# EAGLE design gate (EAGLE 8.5.0)
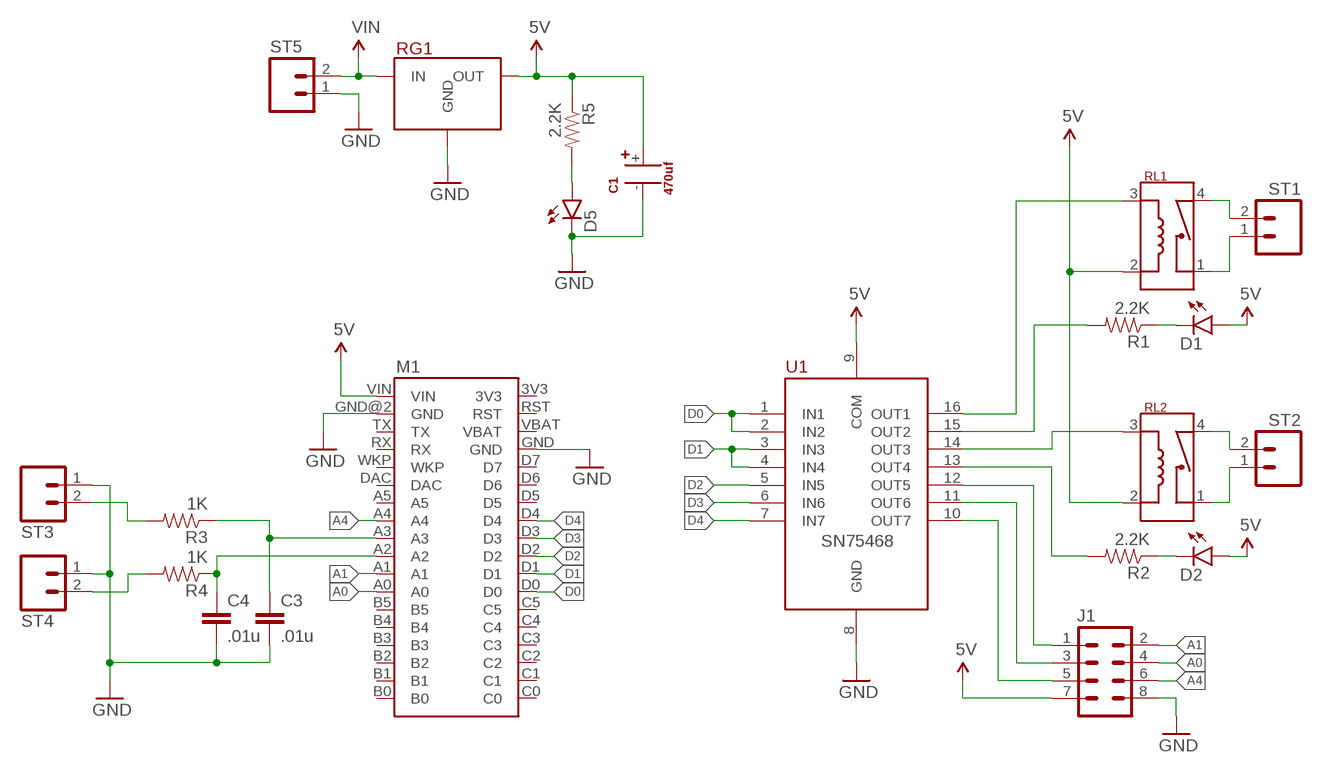
[diagram p0: schematic, sheet 1]

## Parts
C1  470uf  CAPACITOR-AXIAL10X25  [CAP-AXIAL-10X25]
C3  .01u  CAP0603-CAP  [0603-CAP]
C4  .01u  CAP0603-CAP  [0603-CAP]
D1  LED0603  [LED-0603]
D2  LED0603  [LED-0603]
D5  LED0603  [LED-0603]
J1  M04X2  [2X4]
M1  ELECTRON  [ELECTRON]
R1  2.2K  RESISTOR0603  [0603-RES]
R2  2.2K  RESISTOR0603  [0603-RES]
R3  1K  RESISTOR0603  [0603-RES]
R4  1K  RESISTOR0603  [0603-RES]
R5  2.2K  RESISTOR0603  [0603-RES]
RG1  TRACO_TSR_2  [TRACO_TSR_2]
RL1  HE3600_RELAY  [HE3600_RELAY]
RL2  HE3600_RELAY  [HE3600_RELAY]
ST1  SCREWTERM_2  [SCREWTERM_0.2X2]
ST2  SCREWTERM_2  [SCREWTERM_0.2X2]
ST3  SCREWTERM_2  [SCREWTERM_0.2X2]
ST4  SCREWTERM_2  [SCREWTERM_0.2X2]
ST5  SCREWTERM_2  [SCREWTERM_0.2X2]
U1  SN75468  [SOIC16]

## Nets
5V: C1.+ D1.A D2.A J1.7 M1.VIN R5.1 RG1.3(OUT) RL1.2(R1) RL2.2(R1) U1.9(COM)
A0: J1.4 M1.A0
A1: J1.2 M1.A1
A4: J1.6 M1.A4
D0: M1.D0 U1.1(IN1) U1.2(IN2)
D1: M1.D1 U1.3(IN3) U1.4(IN4)
D2: M1.D2 U1.5(IN5)
D3: M1.D3 U1.6(IN6)
D4: M1.D4 U1.7(IN7)
GND: C1.- C3.2 C4.2 D5.C J1.8 M1.GND M1.GND@2(GND) RG1.2(GND) ST3.1 ST4.1 ST5.1 U1.8(GND)
L5: J1.1 U1.12(OUT5)
L6: J1.3 U1.11(OUT6)
L7: J1.5 U1.10(OUT7)
N$1: D2.C R2.1
N$2: RL1.4(C2) ST1.2
N$3: D1.C R1.1
N$4: RL2.4(C2) ST2.2
N$5: R2.2 U1.13(OUT4)
N$6: R1.2 U1.15(OUT2)
N$7: C4.1 M1.A2 R4.1
N$8: C3.1 M1.A3 R3.1
N$9: RL2.1(C1) ST2.1
N$13: RL1.1(C1) ST1.1
N$14: D5.A R5.2
N$17: R4.2 ST4.2
N$18: R3.2 ST3.2
N$22: RL2.3(R2) U1.14(OUT3)
N$33: RL1.3(R2) U1.16(OUT1)
VIN: RG1.1(IN) ST5.2
Unconnected: M1.A5 M1.B0 M1.B1 M1.B2 M1.B3 M1.B4 M1.B5 M1.C0 M1.C1 M1.C2 M1.C3 M1.C4 M1.C5 M1.D5 M1.D6 M1.D7 M1.DAC M1.RST M1.RX M1.TX M1.VBAT M1.WKP

## Power pins joined to a net without a drawn wire
3V3: M1.3V3

## Library data of the parts
C1 = Puffin:CAPACITOR-AXIAL
C3 C4 = SparkFun-Capacitors:CAP: Capacitor Standard 0603 ceramic capacitor, and 0.1" leaded capacitor.
D1 D2 D5 = SparkFun-LED:LED: LEDs Standard schematic elements and footprints for 5mm, 3mm, 1206, and 0603 sized LEDs. 5mm - Spark Fun Electronics SKU : COM-00529 (and others)
J1 = SparkFun-Connectors:M04X2: .1" header, two rows of four.
M1 = Puffin:ELECTRON
R1-R5 = SparkFun-Resistors:RESISTOR: Resistor Basic schematic elements and footprints for 0603, 1206, and PTH resistors.
RG1 = Puffin:TRACO_TSR_2
RL1 RL2 = Puffin:HE3600_RELAY
ST1-ST5 = Puffin:SCREWTERM_2
U1 = Puffin:SN75468

## Board
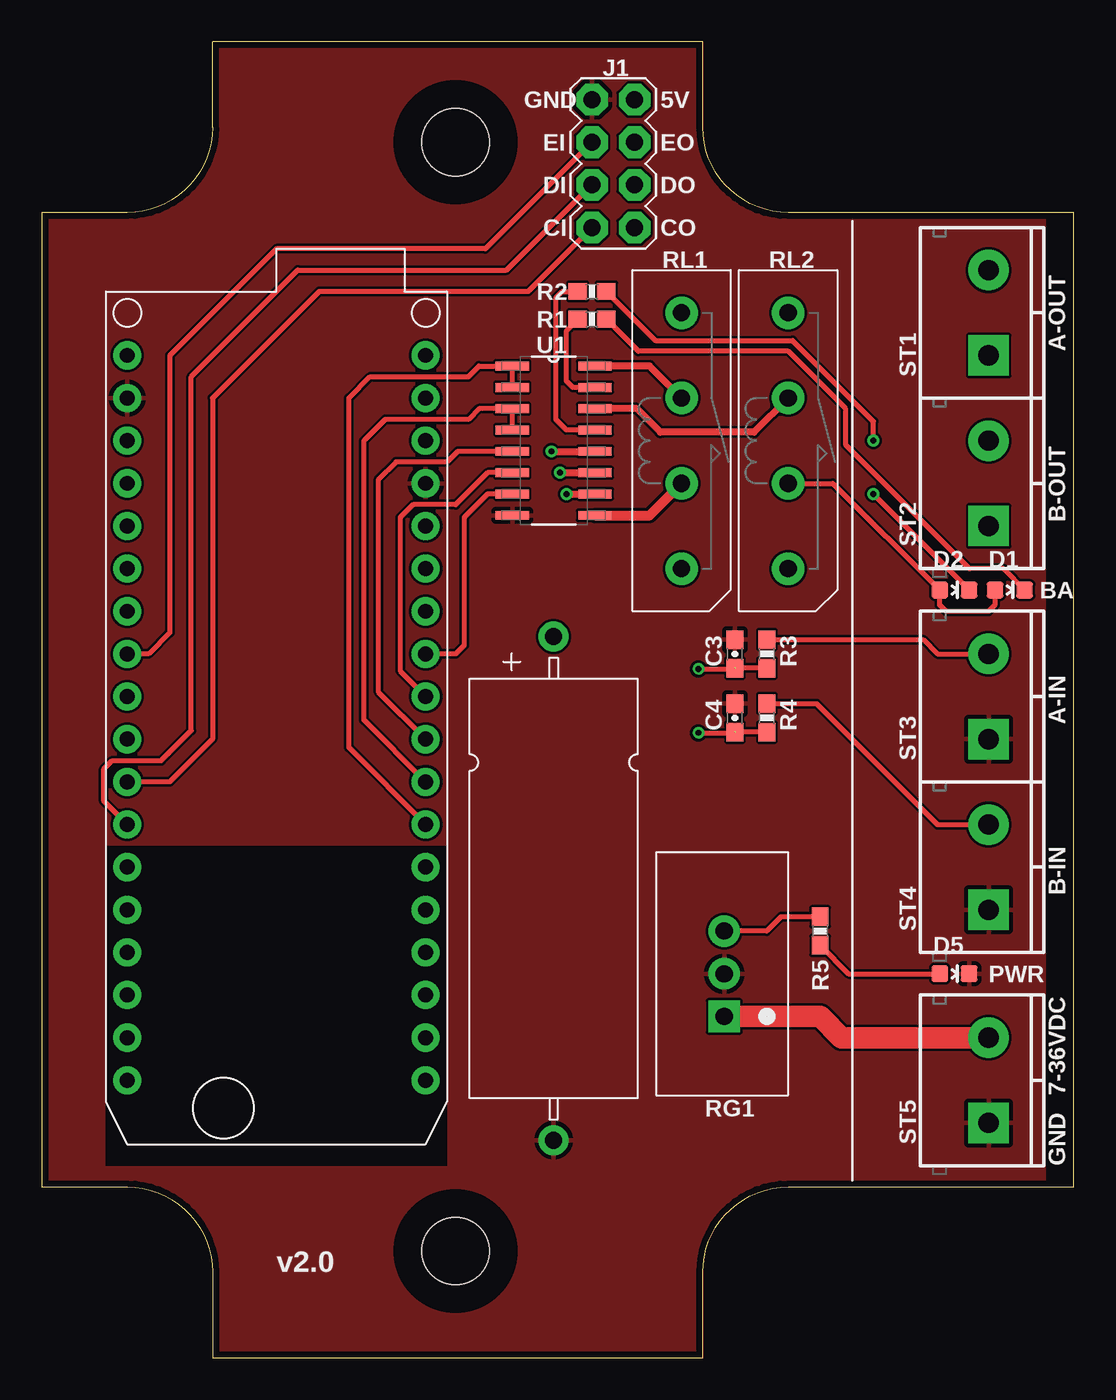
[diagram p1: board, top side]
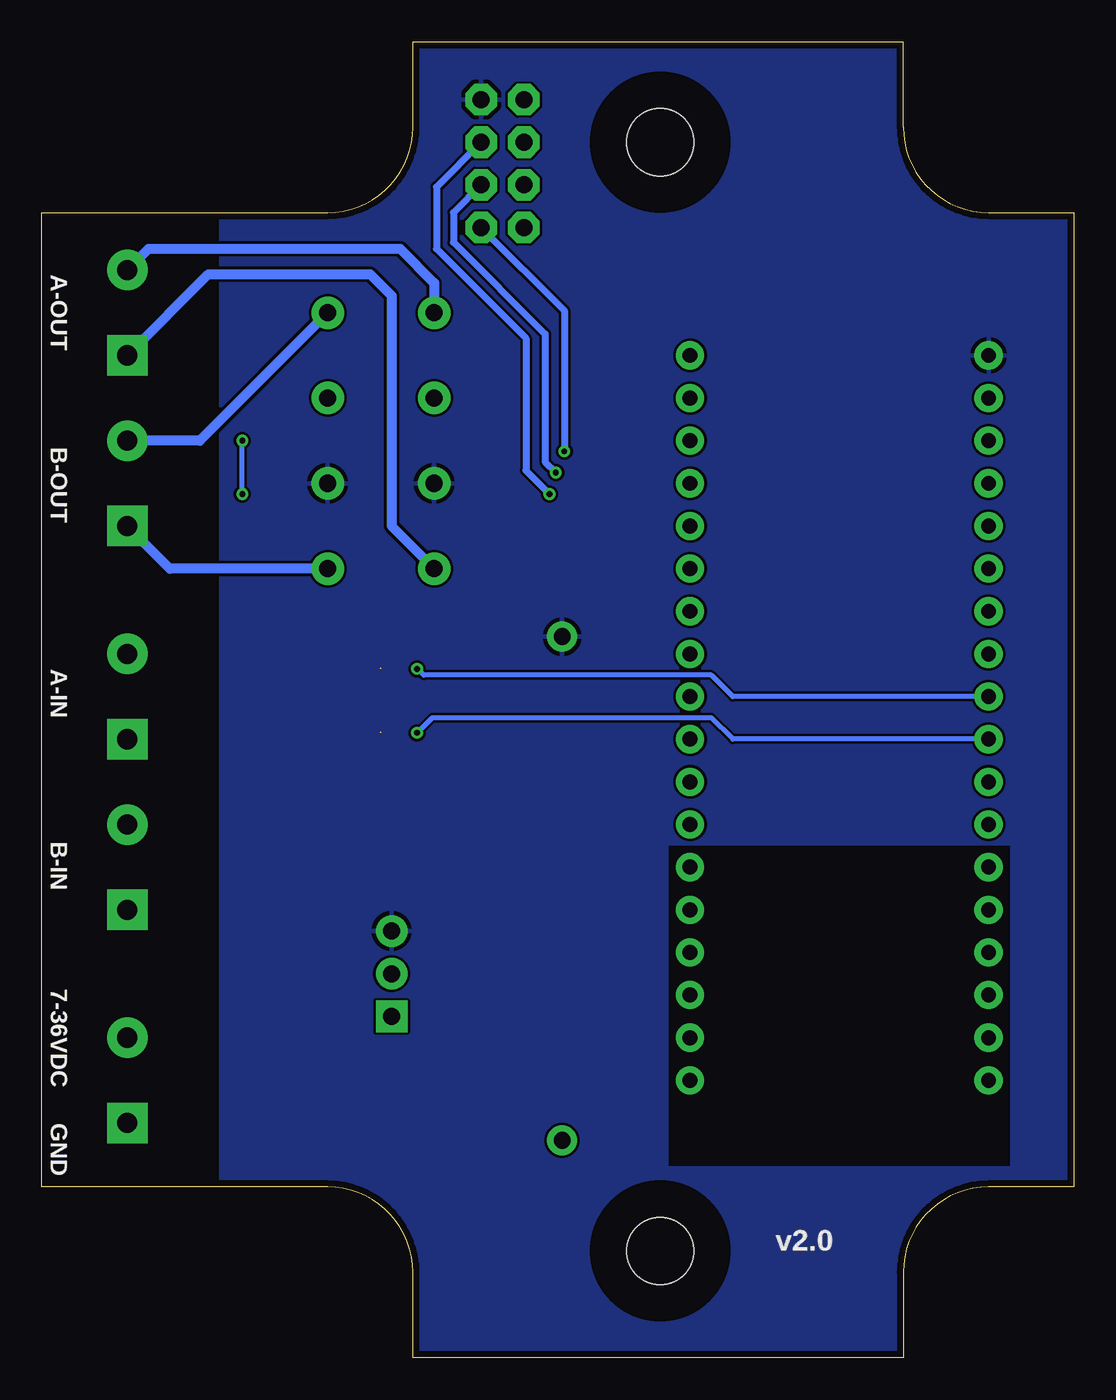
[diagram p2: board, bottom side, seen from below]

Size 61.47 x 78.36 mm. Coordinates in mm from the lower left corner, seen from the top.
Outline: 39.37,73.28 39.37,78.36 10.16,78.36 10.16,73.28 arc-90 5.08,68.2 0,68.2 0,10.16 5.08,10.16 arc-90 10.16,5.08 10.16,0 39.37,0 39.37,5.08 arc-90 44.45,10.16 61.47,10.16 61.47,68.2 44.45,68.2
Outline: 44.45,68.2 arc-90 39.37,73.28
Outline: 44.45,68.2 arc-90 39.37,73.28
Copper layers (1*16): Top 0.0356mm / dielectric 1.5011mm / Bottom 0.0356mm
Design rules "oshpark-2layer": minimum track width 6mil, minimum drill 13mil, track to track 6mil, track to pad 6mil, pad to pad 6mil, via to via 6mil, smd to smd 6mil, copper to edge 15mil, drill to drill 6mil, minimum pad ring 7mil, minimum via ring 7mil, stop-mask expansion 2.5mil, vias tented up to drill 0mil, thermal gap 10mil
Holes 3.99 mm at 24.64,72.39 24.64,6.35
tRestrict: area 21.1,68.8 to 28.2,75.9; area 21.1,2.8 to 28.2,9.9; area 3.8,11.4 to 24.1,30.5
bRestrict: area 20.6,68.3 to 28.7,76.5; area 20.6,2.3 to 28.7,10.4; area 3.8,11.4 to 24.1,30.5

### Footprints (pad centres in the part's own frame; a part is rotated, then mirrored left to right if it is on the bottom)
CAP-AXIAL-10X25 = drill 1 pad 1.778: + 15,0; - -15,0
0603-CAP = smd 1.1 x 1: 1 -0.85,0; 2 0.85,0
LED-0603 = smd 1 x 1: A 0,-0.877; C 0,0.877
2X4 = drill 1.016 pad 1.88 octagon: 1 -3.81,-1.27; 2 -3.81,1.27; 3 -1.27,-1.27; 4 -1.27,1.27; 5 1.27,-1.27; 6 1.27,1.27; 7 3.81,-1.27; 8 3.81,1.27
ELECTRON = drill 0.889 pad 1.676: 3V3 17.78,0; A0 0,-27.94; A1 0,-25.4; A2 0,-22.86; A3 0,-20.32; A4 0,-17.78; A5 0,-15.24; B0 0,-43.18; B1 0,-40.64; B2 0,-38.1; B3 0,-35.56; B4 0,-33.02; B5 0,-30.48; C0 17.78,-43.18; C1 17.78,-40.64; C2 17.78,-38.1; C3 17.78,-35.56; C4 17.78,-33.02; C5 17.78,-30.48; D0 17.78,-27.94; D1 17.78,-25.4; D2 17.78,-22.86; D3 17.78,-20.32; D4 17.78,-17.78; D5 17.78,-15.24; D6 17.78,-12.7; D7 17.78,-10.16; DAC 0,-12.7; GND 17.78,-7.62; GND@2 0,-2.54; RST 17.78,-2.54; RX 0,-7.62; TX 0,-5.08; VBAT 17.78,-5.08; VIN 0,0; WKP 0,-10.16
0603-RES = smd 1.1 x 1: 1 -0.85,0; 2 0.85,0
TRACO_TSR_2 = drill 1.016 pad 1.88 square: 1 -2.54,0 | drill 1.016 pad 1.88: 2 0,0; 3 2.54,0
HE3600_RELAY = drill 1.016 pad 1.93: 1 0,0; 2 0,-5.08; 3 0,-10.16; 4 0,-15.24
SCREWTERM_0.2X2 = drill 1.2 pad 2.413 square: 1 0,0 | drill 1.2 pad 2.413: 2 5.08,0
SOIC16 = smd 1.981 x 0.533: 1 -2.464,4.445; 2 -2.464,3.175; 3 -2.464,1.905; 4 -2.464,0.635; 5 -2.464,-0.635; 6 -2.464,-1.905; 7 -2.464,-3.175; 8 -2.464,-4.445; 9 2.464,-4.445; 10 2.464,-3.175; 11 2.464,-1.905; 12 2.464,-0.635; 13 2.464,0.635; 14 2.464,1.905; 15 2.464,3.175; 16 2.464,4.445

### Placement (x,y rotation side)
C1  30.48,27.94 90 top
C3  41.28,41.91 90 top
C4  41.28,38.1 90 top
D1  57.66,45.72 270 top
D2  54.36,45.72 270 top
D5  54.36,22.86 270 top
J1  34.04,71.12 90 top
M1  5.08,59.69 0 top
R1  32.77,61.85 180 top
R2  32.77,63.5 180 top
R3  43.18,41.91 90 top
R4  43.18,38.1 90 top
R5  46.36,25.4 270 top
RG1  40.64,22.86 90 top
RL1  38.1,46.99 180 top
RL2  44.45,46.99 180 top
ST1  56.39,59.69 90 top
ST2  56.39,49.53 90 top
ST3  56.39,36.83 90 top
ST4  56.39,26.67 90 top
ST5  56.39,13.97 90 top
U1  30.48,54.61 0 top

### Tracks (layer width: path | path; a pad name or v marks a point on that pad's centre or on a via)
5V
  Top 0.305: RL2.2 47.11,52.07 D2.A 53.48,44.82 53.85,44.45 56.39,44.45 56.78,44.84 D1.A | R5.1 44.03,26.25 43.18,25.4 RG1.3
  Top 0.61: U1.9 36.2,50.17 RL1.2
  pour Bottom: -1.27,80.01 -1.27,-2.54 50.8,-2.54 50.8,80.01
A0
  Top 0.305: M1.A0 3.68,33.15 3.68,35.05 4.19,35.56 7.11,35.56 8.89,37.34 8.89,58.42 15.24,64.77 27.69,64.77 J1.4
A1
  Top 0.305: J1.2 28.96,63.5 16.51,63.5 10.16,57.15 10.16,36.83 7.62,34.29 M1.A1
A4
  Top 0.305: J1.6 26.42,66.04 13.97,66.04 7.62,59.69 7.62,43.18 6.35,41.91 M1.A4
D0
  Top 0.305: M1.D0 18.29,36.32 18.29,57.15 19.56,58.42 25.4,58.42 26.04,59.05 U1.1 U1.2
D1
  Top 0.305: M1.D1 19.18,37.97 19.18,54.61 20.45,55.88 25.4,55.88 26.04,56.52 U1.3 U1.4
D2
  Top 0.305: M1.D2 20.07,39.62 20.07,52.32 21.08,53.34 24.13,53.34 24.77,53.98 U1.5
D3
  Top 0.305: M1.D3 21.34,40.89 21.34,50.04 22.1,50.8 24.64,50.8 26.54,52.71 U1.6
D4
  Top 0.305: U1.7 26.54,51.44 25.15,50.04 25.15,42.42 24.64,41.91 M1.D4
GND
  pour Top: 0,81.28 0,-1.27 59.69,-1.27 59.69,81.28
L5  (via drill 0.35)
  Top 0.406: v30.35,53.98 U1.12
  Bottom 0.406: J1.1 30.35,62.36 v30.35,53.98
L6  (via drill 0.35)
  Top 0.406: v30.86,52.71 U1.11
  Bottom 0.406: J1.3 36.96,68.2 36.96,66.42 31.5,60.96 31.5,53.34 v30.86,52.71
L7  (via drill 0.35)
  Top 0.406: v31.24,51.44 U1.10
  Bottom 0.406: J1.5 37.97,69.72 37.97,66.04 32.64,60.71 32.64,52.83 v31.24,51.44
N$1  (via drill 0.35)
  Top 0.305: D2.C v49.53,51.42 v49.53,51.44 | v49.53,54.61 49.53,55.75 44.7,60.58 36.54,60.58 R2.1
  Bottom 0.305: v49.53,51.44 v49.53,54.61
N$2
  Bottom 0.61: ST1.2 55.12,66.04 40.13,66.04 38.1,64.01 RL1.4
N$3
  Top 0.305: R1.1 35.52,59.94 44.45,59.94 47.88,56.52 47.88,54.36 55.25,46.99 57.29,46.99 D1.C
N$4
  Bottom 0.61: RL2.4 52.07,54.61 ST2.2
N$5
  Top 0.305: U1.13 31.24,55.25 30.61,55.88 30.61,63.12 30.99,63.5 R2.2
N$6
  Top 0.305: U1.15 31.62,57.79 31.24,58.17 31.24,61.13 R1.2
N$7  (via drill 0.35)  (1 unrouted)
  Top 0.305: R4.1 41.31,37.25 | v39.12,37.21 41.28,37.21
  Top 0.406: 41.31,37.25 41.28,37.21
  Bottom 0.305: M1.A2 20.32,36.83 21.59,38.1 38.23,38.1 v39.12,37.21
N$8  (via drill 0.35)  (1 unrouted)
  Top 0.305: R3.1 41.31,41.06 | v39.12,41.02 41.28,41.02
  Top 0.406: 41.31,41.06 41.28,41.02
  Bottom 0.305: M1.A3 20.32,39.37 21.59,40.64 38.74,40.64 v39.12,41.02
N$9
  Bottom 0.61: RL2.1 53.85,46.99 ST2.1
N$13
  Bottom 0.61: ST1.1 51.56,64.52 41.91,64.52 40.64,63.25 40.64,49.53 RL1.1
N$14
  Top 0.305: R5.2 48.05,22.86 D5.A
N$17
  Top 0.305: R4.2 46.14,38.95 53.34,31.75 ST4.2
N$18
  Top 0.305: R3.2 52.49,42.76 53.34,41.91 ST3.2
N$22
  Top 0.406: U1.14 35.43,56.52 36.83,55.12 42.42,55.12 RL2.3
N$33
  Top 0.406: RL1.3 36.2,59.05 U1.16
VIN
  Top 1.27: ST5.2 47.62,19.05 46.36,20.32 RG1.1

### Text on the board
tPlace: GND | 5V | EI | EO | DI | DO | CI | CO | A-OUT | B-OUT | BA | A-IN | B-IN | PWR | 7-36VDC | GND | v2.0
bPlace: A-OUT | B-OUT | A-IN | B-IN | 7-36VDC | GND | v2.0